# EAGLE design anvil_driver (EAGLE 6.4)
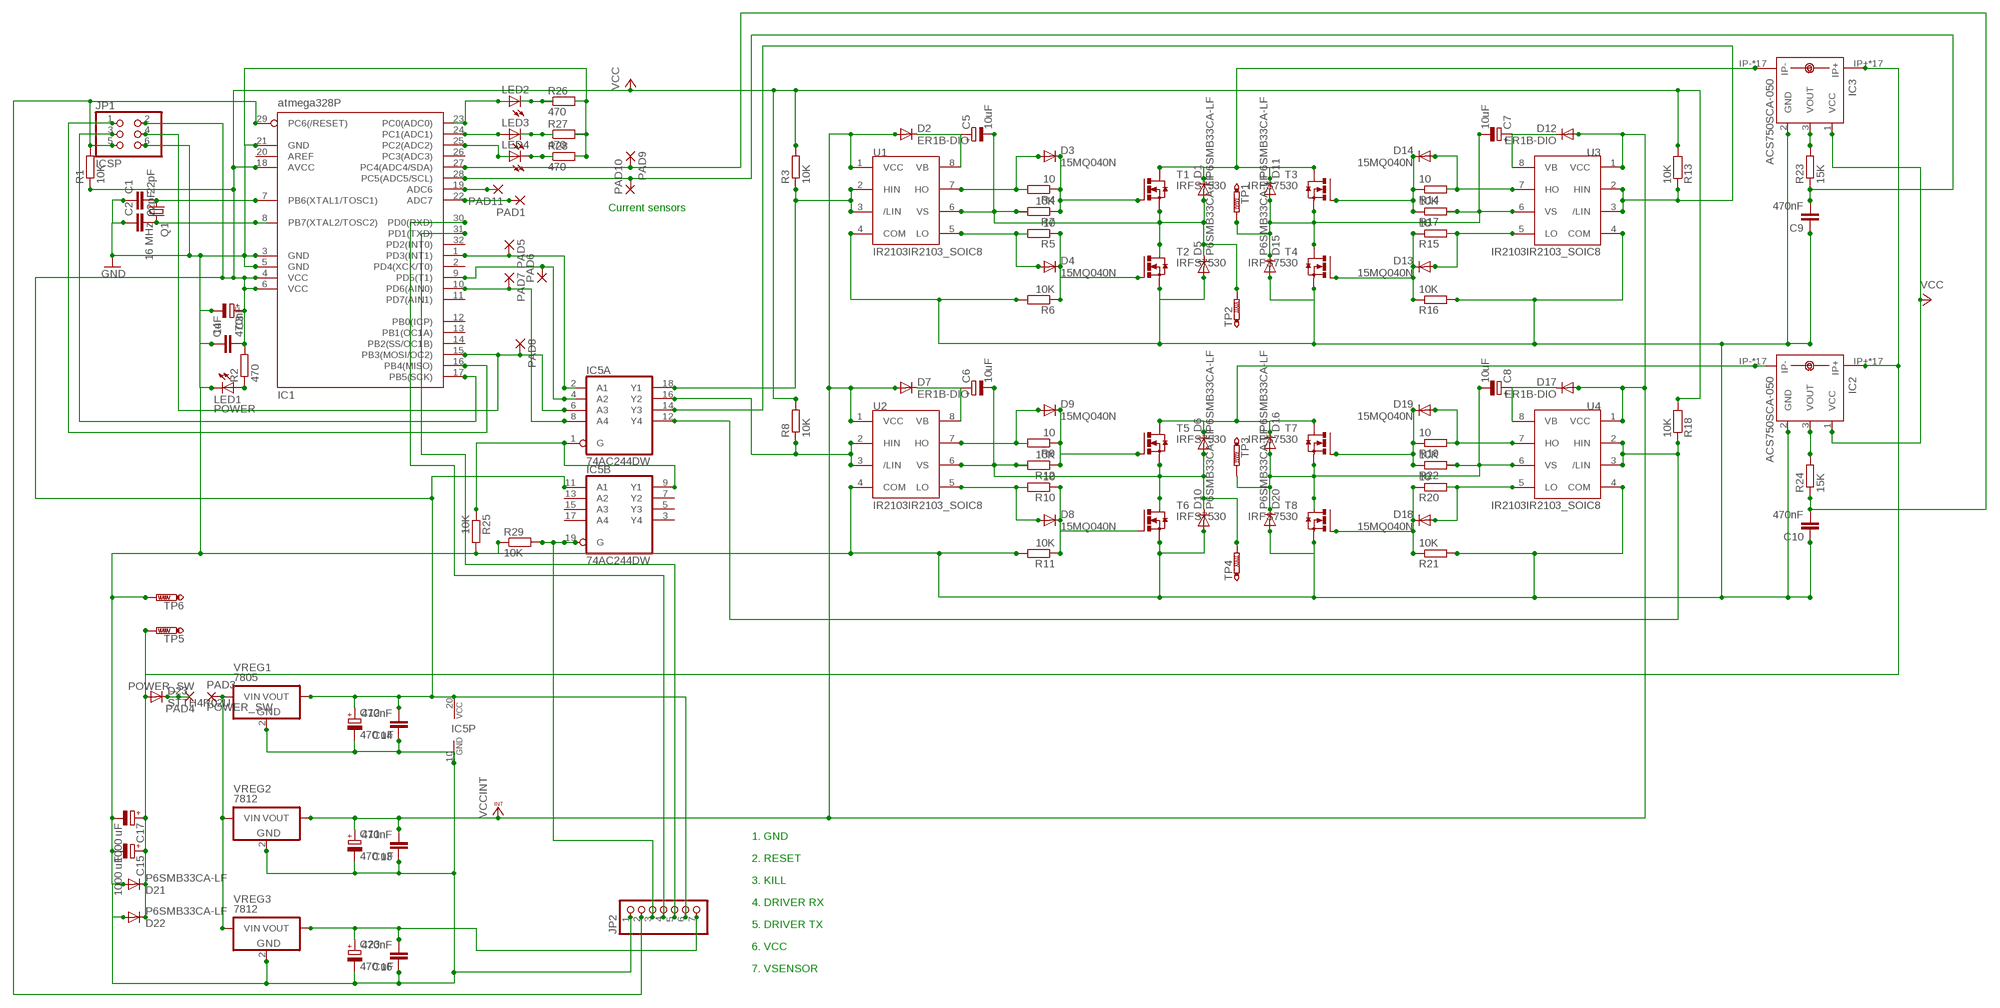
[diagram p0: schematic, sheet 1]

## Parts
C1  22pF  C-EUC1206  [C1206]
C2  22pF  C-EUC1206  [C1206]
C3  1uF  CPOL-EU153CLV-0405  [153CLV-0405]
C4  470nF  C-EUC1206  [C1206]
C5  10uF  CPOL-EU153CLV-0405  [153CLV-0405]
C6  10uF  CPOL-EU153CLV-0405  [153CLV-0405]
C7  10uF  CPOL-EU153CLV-0405  [153CLV-0405]
C8  10uF  CPOL-EU153CLV-0405  [153CLV-0405]
C9  470nF  C-EUC1206  [C1206]
C10  470nF  C-EUC1206  [C1206]
C11  470 uF  CPOL-EU139CLL-2W  [139CLL-2W]
C12  470 uF  CPOL-EU139CLL-2W  [139CLL-2W]
C13  470nF  C-EUC1206  [C1206]
C14  470nF  C-EUC1206  [C1206]
C15  1000 uF  CPOL-EU139CLL-2W  [139CLL-2W]
C16  470nF  C-EUC1206  [C1206]
C17  1000 uF  CPOL-EU139CLL-2W  [139CLL-2W]
C23  470 uF  CPOL-EU139CLL-2W  [139CLL-2W]
D1  P6SMB33CA-LF  DIODE-DO214AA  [DO214AA]
D2  ER1B-DIO  DIODE-DO214AC  [DO214AC]
D3  15MQ040N  DIODE-DO214AC  [DO214AC]
D4  15MQ040N  DIODE-DO214AC  [DO214AC]
D5  P6SMB33CA-LF  DIODE-DO214AA  [DO214AA]
D6  P6SMB33CA-LF  DIODE-DO214AA  [DO214AA]
D7  ER1B-DIO  DIODE-DO214AC  [DO214AC]
D8  15MQ040N  DIODE-DO214AC  [DO214AC]
D9  15MQ040N  DIODE-DO214AC  [DO214AC]
D10  P6SMB33CA-LF  DIODE-DO214AA  [DO214AA]
D11  P6SMB33CA-LF  DIODE-DO214AA  [DO214AA]
D12  ER1B-DIO  DIODE-DO214AC  [DO214AC]
D13  15MQ040N  DIODE-DO214AC  [DO214AC]
D14  15MQ040N  DIODE-DO214AC  [DO214AC]
D15  P6SMB33CA-LF  DIODE-DO214AA  [DO214AA]
D16  P6SMB33CA-LF  DIODE-DO214AA  [DO214AA]
D17  ER1B-DIO  DIODE-DO214AC  [DO214AC]
D18  15MQ040N  DIODE-DO214AC  [DO214AC]
D19  15MQ040N  DIODE-DO214AC  [DO214AC]
D20  P6SMB33CA-LF  DIODE-DO214AA  [DO214AA]
D21  P6SMB33CA-LF  DIODE-DO214AA  [DO214AA]
D22  P6SMB33CA-LF  DIODE-DO214AA  [DO214AA]
D23  STTH4R02U  DIODE-DO214AA  [DO214AA]
IC1  atmega328P  MEGA8-AI  [TQFP32-08]
IC2  ACS750SCA-050  [ACS75050]
IC3  ACS750SCA-050  [ACS75050]
IC5  74AC244DW  [SO20W]
JP1  ICSP  PINHD-2X3_2.54-SMD  [2X03SMD]
JP2  PINHD-1X7_2.54  [1X07]
LED1  POWER  LEDSMT1206  [1206]
LED2  LEDSMT1206  [1206]
LED3  LEDSMT1206  [1206]
LED4  LEDSMT1206  [1206]
PAD1  SMD2  [SMD1,27-2,54]
PAD3  POWER_SW  1,6/0,8  [1,6/0,8]
PAD4  POWER_SW  1,6/0,8  [1,6/0,8]
PAD5  SMD2  [SMD1,27-2,54]
PAD6  SMD2  [SMD1,27-2,54]
PAD7  SMD2  [SMD1,27-2,54]
PAD8  SMD2  [SMD1,27-2,54]
PAD9  SMD2  [SMD1,27-2,54]
PAD10  SMD2  [SMD1,27-2,54]
PAD11  SMD2  [SMD1,27-2,54]
Q1  16 MHz  CSM-7X-DU  [CSM-7X-DU]
R1  10K  R-EU_M1206  [M1206]
R2  470  R-EU_M1206  [M1206]
R3  10K  R-EU_M1206  [M1206]
R4  10  R-EU_M1206  [M1206]
R5  10  R-EU_M1206  [M1206]
R6  10K  R-EU_M1206  [M1206]
R7  10K  R-EU_M1206  [M1206]
R8  10K  R-EU_M1206  [M1206]
R9  10  R-EU_M1206  [M1206]
R10  10  R-EU_M1206  [M1206]
R11  10K  R-EU_M1206  [M1206]
R12  10K  R-EU_M1206  [M1206]
R13  10K  R-EU_M1206  [M1206]
R14  10  R-EU_M1206  [M1206]
R15  10  R-EU_M1206  [M1206]
R16  10K  R-EU_M1206  [M1206]
R17  10K  R-EU_M1206  [M1206]
R18  10K  R-EU_M1206  [M1206]
R19  10  R-EU_M1206  [M1206]
R20  10  R-EU_M1206  [M1206]
R21  10K  R-EU_M1206  [M1206]
R22  10K  R-EU_M1206  [M1206]
R23  15K  R-EU_M1206  [M1206]
R24  15K  R-EU_M1206  [M1206]
R25  10K  R-EU_M1206  [M1206]
R26  470  R-EU_M1206  [M1206]
R27  470  R-EU_M1206  [M1206]
R28  470  R-EU_M1206  [M1206]
R29  10K  R-EU_M1206  [M1206]
T1  IRFS7530  IRF3805S  [DDPAK7]
T2  IRFS7530  IRF3805S  [DDPAK7]
T3  IRFS7530  IRF3805S  [DDPAK7]
T4  IRFS7530  IRF3805S  [DDPAK7]
T5  IRFS7530  IRF3805S  [DDPAK7]
T6  IRFS7530  IRF3805S  [DDPAK7]
T7  IRFS7530  IRF3805S  [DDPAK7]
T8  IRFS7530  IRF3805S  [DDPAK7]
TP1  PTR1PAD1-20  [P1-20]
TP2  PTR1PAD1-20  [P1-20]
TP3  PTR1PAD1-20  [P1-20]
TP4  PTR1PAD1-20  [P1-20]
TP5  PTR1PAD1-20  [P1-20]
TP6  PTR1PAD1-20  [P1-20]
U1  IR2103IR2103_SOIC8  [SO08]
U2  IR2103IR2103_SOIC8  [SO08]
U3  IR2103IR2103_SOIC8  [SO08]
U4  IR2103IR2103_SOIC8  [SO08]
VREG1  7805  VREG_3PINS-D2PAK  [D2PAK]
VREG2  7812  VREG_3PINS-D2PAK  [D2PAK]
VREG3  7812  VREG_3PINS-D2PAK  [D2PAK]

## Nets
GND: C1.1 C2.1 C3.- C4.1 C9.1 C10.1 C11.- C12.- C13.1 C14.1 C15.- C16.1 C17.- C23.- D5.A D10.A D15.A D20.A D21.A D22.A IC1.3(GND) IC1.5(GND) IC1.21(GND) IC2.2(GND) IC3.2(GND) IC5.10(P:GND) JP1.6 JP2.1 LED1.C R6.2 R11.2 R16.2 R21.2 R25.2 R26.2 R27.2 R28.2 R29.1 T2.2(S) T2.3(S) T2.5(S) T2.6(S) T2.7(S) T4.2(S) T4.3(S) T4.5(S) T4.6(S) T4.7(S) T6.2(S) T6.3(S) T6.5(S) T6.6(S) T6.7(S) T8.2(S) T8.3(S) T8.5(S) T8.6(S) T8.7(S) TP6.TP U1.4(COM) U2.4(COM) U3.4(COM) U4.4(COM) VREG1.2(GND) VREG2.2(GND) VREG3.2(GND)
N$1: D1.C D11.C IC3.IP- IC3.IP-@2(IP-) IC3.IP-@3(IP-) IC3.IP-@4(IP-) IC3.IP-@5(IP-) IC3.IP-@6(IP-) IC3.IP-@7(IP-) IC3.IP-@8(IP-) IC3.IP-@9(IP-) IC3.IP-@10(IP-) IC3.IP-@11(IP-) IC3.IP-@12(IP-) IC3.IP-@13(IP-) IC3.IP-@14(IP-) IC3.IP-@15(IP-) IC3.IP-@16(IP-) IC3.IP-@17(IP-) T1.4(D) T3.4(D)
N$2: IC5.18(A:Y1) R3.1 U1.2(HIN) U1.3(/LIN)
N$3: IC1.24(PC1(ADC1)) LED3.A
N$4: IC1.1(PD3(INT1)) IC5.2(A:A1) PAD5.1(P)
N$5: IC1.16(PB4(MISO)) JP1.1
N$6: IC1.17(PB5(SCK)) JP1.3
N$8: C1.2 IC1.7(PB6(XTAL1/TOSC1)) Q1.1
N$9: C2.2 IC1.8(PB7(XTAL2/TOSC2)) Q1.2
N$10: C5.- D1.A D5.C R7.2 T1.2(S) T1.3(S) T1.5(S) T1.6(S) T1.7(S) T2.4(D) TP2.TP U1.6(VS)
N$11: LED1.A R2.1
N$12: D3.A R4.2 U1.7(HO)
N$13: D4.A R5.2 U1.5(LO)
N$14: D4.C R5.1 R6.1 T2.1(G)
N$15: D3.C R4.1 R7.1 T1.1(G)
N$16: C15.+ C17.+ D21.C D22.C D23.A IC2.IP+ IC2.IP+@2(IP+) IC2.IP+@3(IP+) IC2.IP+@4(IP+) IC2.IP+@5(IP+) IC2.IP+@6(IP+) IC2.IP+@7(IP+) IC2.IP+@8(IP+) IC2.IP+@9(IP+) IC2.IP+@10(IP+) IC2.IP+@11(IP+) IC2.IP+@12(IP+) IC2.IP+@13(IP+) IC2.IP+@14(IP+) IC2.IP+@15(IP+) IC2.IP+@16(IP+) IC2.IP+@17(IP+) IC3.IP+ IC3.IP+@2(IP+) IC3.IP+@3(IP+) IC3.IP+@4(IP+) IC3.IP+@5(IP+) IC3.IP+@6(IP+) IC3.IP+@7(IP+) IC3.IP+@8(IP+) IC3.IP+@9(IP+) IC3.IP+@10(IP+) IC3.IP+@11(IP+) IC3.IP+@12(IP+) IC3.IP+@13(IP+) IC3.IP+@14(IP+) IC3.IP+@15(IP+) IC3.IP+@16(IP+) IC3.IP+@17(IP+) TP5.TP
N$17: IC5.16(A:Y2) R8.1 U2.2(HIN) U2.3(/LIN)
N$18: D6.C D16.C IC2.IP- IC2.IP-@2(IP-) IC2.IP-@3(IP-) IC2.IP-@4(IP-) IC2.IP-@5(IP-) IC2.IP-@6(IP-) IC2.IP-@7(IP-) IC2.IP-@8(IP-) IC2.IP-@9(IP-) IC2.IP-@10(IP-) IC2.IP-@11(IP-) IC2.IP-@12(IP-) IC2.IP-@13(IP-) IC2.IP-@14(IP-) IC2.IP-@15(IP-) IC2.IP-@16(IP-) IC2.IP-@17(IP-) T5.4(D) T7.4(D)
N$19: C6.- D6.A D10.C R12.2 T5.2(S) T5.3(S) T5.5(S) T5.6(S) T5.7(S) T6.4(D) TP4.TP U2.6(VS)
N$20: D9.A R9.2 U2.7(HO)
N$21: D8.A R10.2 U2.5(LO)
N$22: D8.C R10.1 R11.1 T6.1(G)
N$23: D9.C R9.1 R12.1 T5.1(G)
N$24: C9.2 IC1.28(PC5(ADC5/SCL)) PAD10.1(P) R23.1
N$25: IC3.3(VOUT) R23.2
N$26: IC5.14(A:Y3) R13.1 U3.2(HIN) U3.3(/LIN)
N$27: C7.- D11.A D15.C R17.2 T3.2(S) T3.3(S) T3.5(S) T3.6(S) T3.7(S) T4.4(D) TP1.TP U3.6(VS)
N$28: D14.A R14.2 U3.7(HO)
N$29: D13.A R15.2 U3.5(LO)
N$30: D13.C R15.1 R16.1 T4.1(G)
N$31: D14.C R14.1 R17.1 T3.1(G)
N$32: C10.2 IC1.27(PC4(ADC4/SDA)) PAD9.1(P) R24.1
N$33: D23.C PAD4.1(P)
N$34: IC1.9(PD5(T1)) IC5.4(A:A2) PAD6.1(P)
N$35: C8.- D16.A D20.C R22.2 T7.2(S) T7.3(S) T7.5(S) T7.6(S) T7.7(S) T8.4(D) TP3.TP U4.6(VS)
N$36: D19.A R19.2 U4.7(HO)
N$37: D18.A R20.2 U4.5(LO)
N$38: D18.C R20.1 R21.1 T8.1(G)
N$39: D19.C R19.1 R22.1 T7.1(G)
N$41: C16.2 C23.+ JP2.7 VREG3.3(VOUT)
N$42: IC1.15(PB3(MOSI/OC2)) IC5.6(A:A3) JP1.4 PAD8.1(P)
N$43: IC1.10(PD6(AIN0)) IC5.8(A:A4) PAD7.1(P)
N$44: LED2.C R26.1
N$45: IC5.12(A:Y4) R18.1 U4.2(HIN) U4.3(/LIN)
N$46: LED3.C R27.1
N$47: IC1.19(ADC6) PAD11.1(P)
N$48: IC1.23(PC0(ADC0)) LED2.A
N$49: LED4.C R28.1
N$50: IC1.31(PD1(TXD))
N$51: IC1.25(PC2(ADC2)) LED4.A
N$52: PAD3.1(P) VREG1.1(VIN) VREG2.1(VIN) VREG3.1(VIN)
N$53: IC2.3(VOUT) R24.2
N$54: IC1.30(PD0(RXD)) JP2.4
N$55: JP2.5
N$56: IC5.1(A:G) IC5.9(B:Y1) R25.1
N$57: IC5.19(B:G) JP2.3 R29.2
N$58: IC1.22(ADC7) PAD1.1(P)
RESET: IC1.29(PC6(/RESET)) JP1.5 JP2.2 R1.2
VB_1: C5.+ D2.C U1.8(VB)
VB_2: C7.+ D12.C U3.8(VB)
VB_3: C8.+ D17.C U4.8(VB)
VB_4: C6.+ D7.C U2.8(VB)
VCC: C3.+ C4.2 C12.+ C14.2 IC1.4(VCC) IC1.6(VCC) IC1.18(AVCC) IC2.1(VCC) IC3.1(VCC) IC5.11(B:A1) IC5.20(P:VCC) JP1.2 JP2.6 R1.1 R2.2 R3.2 R8.2 R13.2 R18.2 VREG1.3(VOUT)
VCCINT: C11.+ C13.2 D2.A D7.A D12.A D17.A U1.1(VCC) U2.1(VCC) U3.1(VCC) U4.1(VCC) VREG2.3(VOUT)
Unconnected: IC1.2(PD4(XCK/T0)) IC1.11(PD7(AIN1)) IC1.12(PB0(ICP)) IC1.13(PB1(OC1A)) IC1.14(PB2(SS/OC1B)) IC1.20(AREF) IC1.26(PC3(ADC3)) IC1.32(PD2(INT0)) IC5.3(B:Y4) IC5.5(B:Y3) IC5.7(B:Y2) IC5.13(B:A2) IC5.15(B:A3) IC5.17(B:A4)

## Notes on the sheet
- Current sensors
- 1. GND
- 2. RESET
- 3. KILL
- 4. DRIVER RX
- 5. DRIVER TX
- 6. VCC
- 7. VSENSOR

## Library data of the parts
C1 C2 C4 C9 C10 C13 C14 C16 = resistor:C-EU: CAPACITOR, European symbol
C3 C5-C8 C11 C12 C15 C17 C23 = resistor:CPOL-EU: POLARIZED CAPACITOR, European symbol
D1-D23 = diode:DIODE-: DIODE
IC1 = atmel:MEGA8: MICROCONTROLLER 8 Kbytes FLASH, 1 kbytes SRAM, 512 bytes EEPROM, USART, 6-channel 10 bit ADC, 2-channel 8 bit ADC Pin compatible with Atmega48, ATMega88, ATMega168 Source: avr.lbr; MPN: ATMEGA8-16AU; OC_FARNELL: 9171371; OC_NEWARK: 73M8863
IC2 IC3 = allegro:ACS750*CA-050: Current Sensor display layer 49 Reference in BRD and place VIAs on circles Source: www.allegromicro.com/datafile/0750-050.pdf; MF: ALLEGRO MICROSYSTEMS, INC.; MPN: ACS750SCA-050; OC_FARNELL: 1457175; OC_NEWARK: 81H6588
IC5 = 74xx-eu:74*244: Octal BUFFER and LINE DRIVER, 3-state
JP1 = pinhead:PINHD-2X3: PIN HEADER
JP2 = pinhead:PINHD-1X7: PIN HEADER
LED1-LED4 = led:LED: LED OSRAM: - CHIPLED LG R971, LG N971, LY N971, LG Q971, LY Q971, LO R971, LY R971 LH N974, LH R974 LS Q976, LO Q976, LY Q976 LO Q996 - Hyper CHIPLED LW Q18S LB Q993, LB Q99A, LB R99A - SideLED LS A670, LO A670, LY A670, LG A670, LP A670 LB A673, LV A673, LT A673, LW A673 LH A674 LY A675 LS A676, LA A676, LO A676, LY A676, LW A676 LS A679, LY A679, LG A679 - Hyper Micro SIDELED® LS Y876, LA Y876, LO Y876, LY Y876 LT Y87S - SmartLED LW L88C, LW L88S LB L89C, LB L89S, LG L890 LS L89K, LO L89K, LY L89K LS L896, LA L896, LO L896, LY L896 - TOPLED LS T670, LO T670, LY T670, LG T670, LP T670 LSG T670, LSP T670, LSY T670, LOP T670, LYG T670 LG T671, LOG T671, LSG T671 LB T673, LV T673, LT T673, LW T673 LH T674 LS T676, LA T676, LO T676, LY T676, LB T676, LH T676, LSB T676, LW T676 LB T67C, LV T67C, LT T67C, LS T67K, LO T67K, LY T67K, LW E67C LS E67B, LA E67B, LO E67B, LY E67B, LB E67C, LV E67C, LT E67C LW T67C LS T679, LY T679, LG T679 LS T770, LO T770, LY T770, LG T770, LP T770 LB T773, LV T773, LT T773, LW T773 LH T774 LS E675, LA E675, LY E675, LS T675 LS T776, LA T776, LO T776, LY T776, LB T776 LHGB T686 LT T68C, LB T68C - Hyper Mini TOPLED® LB M676 - Mini TOPLED Santana® LG M470 LS M47K, LO M47K, LY M47K Source: http://www.osram.convergy.de LUXEON: - LUMILED® LXK2-PW12-R00, LXK2-PW12-S00, LXK2-PW14-U00, LXK2-PW14-V00 LXK2-PM12-R00, LXK2-PM12-S00, LXK2-PM14-U00 LXK2-PE12-Q00, LXK2-PE12-R00, LXK2-PE12-S00, LXK2-PE14-T00, LXK2-PE14-U00 LXK2-PB12-K00, LXK2-PB12-L00, LXK2-PB12-M00, LXK2-PB14-N00, LXK2-PB14-P00, LXK2-PB14-Q00 LXK2-PR12-L00, LXK2-PR12-M00, LXK2-PR14-Q00, LXK2-PR14-R00 LXK2-PD12-Q00, LXK2-PD12-R00, LXK2-PD12-S00 LXK2-PH12-R00, LXK2-PH12-S00 LXK2-PL12-P00, LXK2-PL12-Q00, LXK2-PL12-R00 Source: www.luxeon.com KINGBRIGHT: KA-3528ASYC Source: www.kingbright.com
PAD1 PAD5-PAD11 = wirepad:SMD2: SMD PAD
PAD3 PAD4 = wirepad:1,6/0,8: THROUGH-HOLE PAD
Q1 = crystal:CSM-7X-DU: SMD CRYSTAL Source: www.ecsxtal.com .. Crystal 3.6864MHz CSM_7X_DU.PDF; OC_FARNELL: unknown; OC_NEWARK: unknown
R1-R29 = resistor:R-EU_: RESISTOR, European symbol
T1-T8 = anvil:IRF3805S
TP1-TP6 = testpad:PTR1: TEST PIN
U1-U4 = drivers:IR2103: IR2101 HIGH AND LOW SIDE DRIVER Product Summary VOFFSET 600V max. IO+/- 130 mA / 270 mA VOUT 10 - 20V ton/off (typ.) 160 & 150 ns Delay Matching 50 ns IR2101(S)/IR2102(S) & (PbF) Features ? Floating channel designed for bootstrap operation Fully operational to +600V Tolerant to negative transient voltage dV/dt immune ? Gate drive supply range from 10 to 20V ? Undervoltage lockout ? 3.3V, 5V, and 15V logic input compatible ? Matched propagation delay for both channels ? Outputs in phase with inputs (IR2101) or out of phase with inputs (IR2102) ? Also available LEAD-FREE Description The IR2101(S)/IR2102(S) are high voltage, high speed power MOSFET and IGBT drivers with independent high and low side referenced output channels. Proprietary HVIC and latch immune CMOS technologies enable ruggedized monolithic construction. The logic input is compatible with standard CMOS or LSTTL output, down to 3.3V logic. The output drivers feature a high pulse current buffer stage designed for minimum driver cross-conduction. The floating channel can be used to drive an N-channel power MOSFET or IGBT in the high side configuration which operates up to 600 volts.
VREG1-VREG3 = dp_devices:VREG_3PINS: Various 3 pin voltage regulators in different packages Double check the right pinout for the right part

## Board
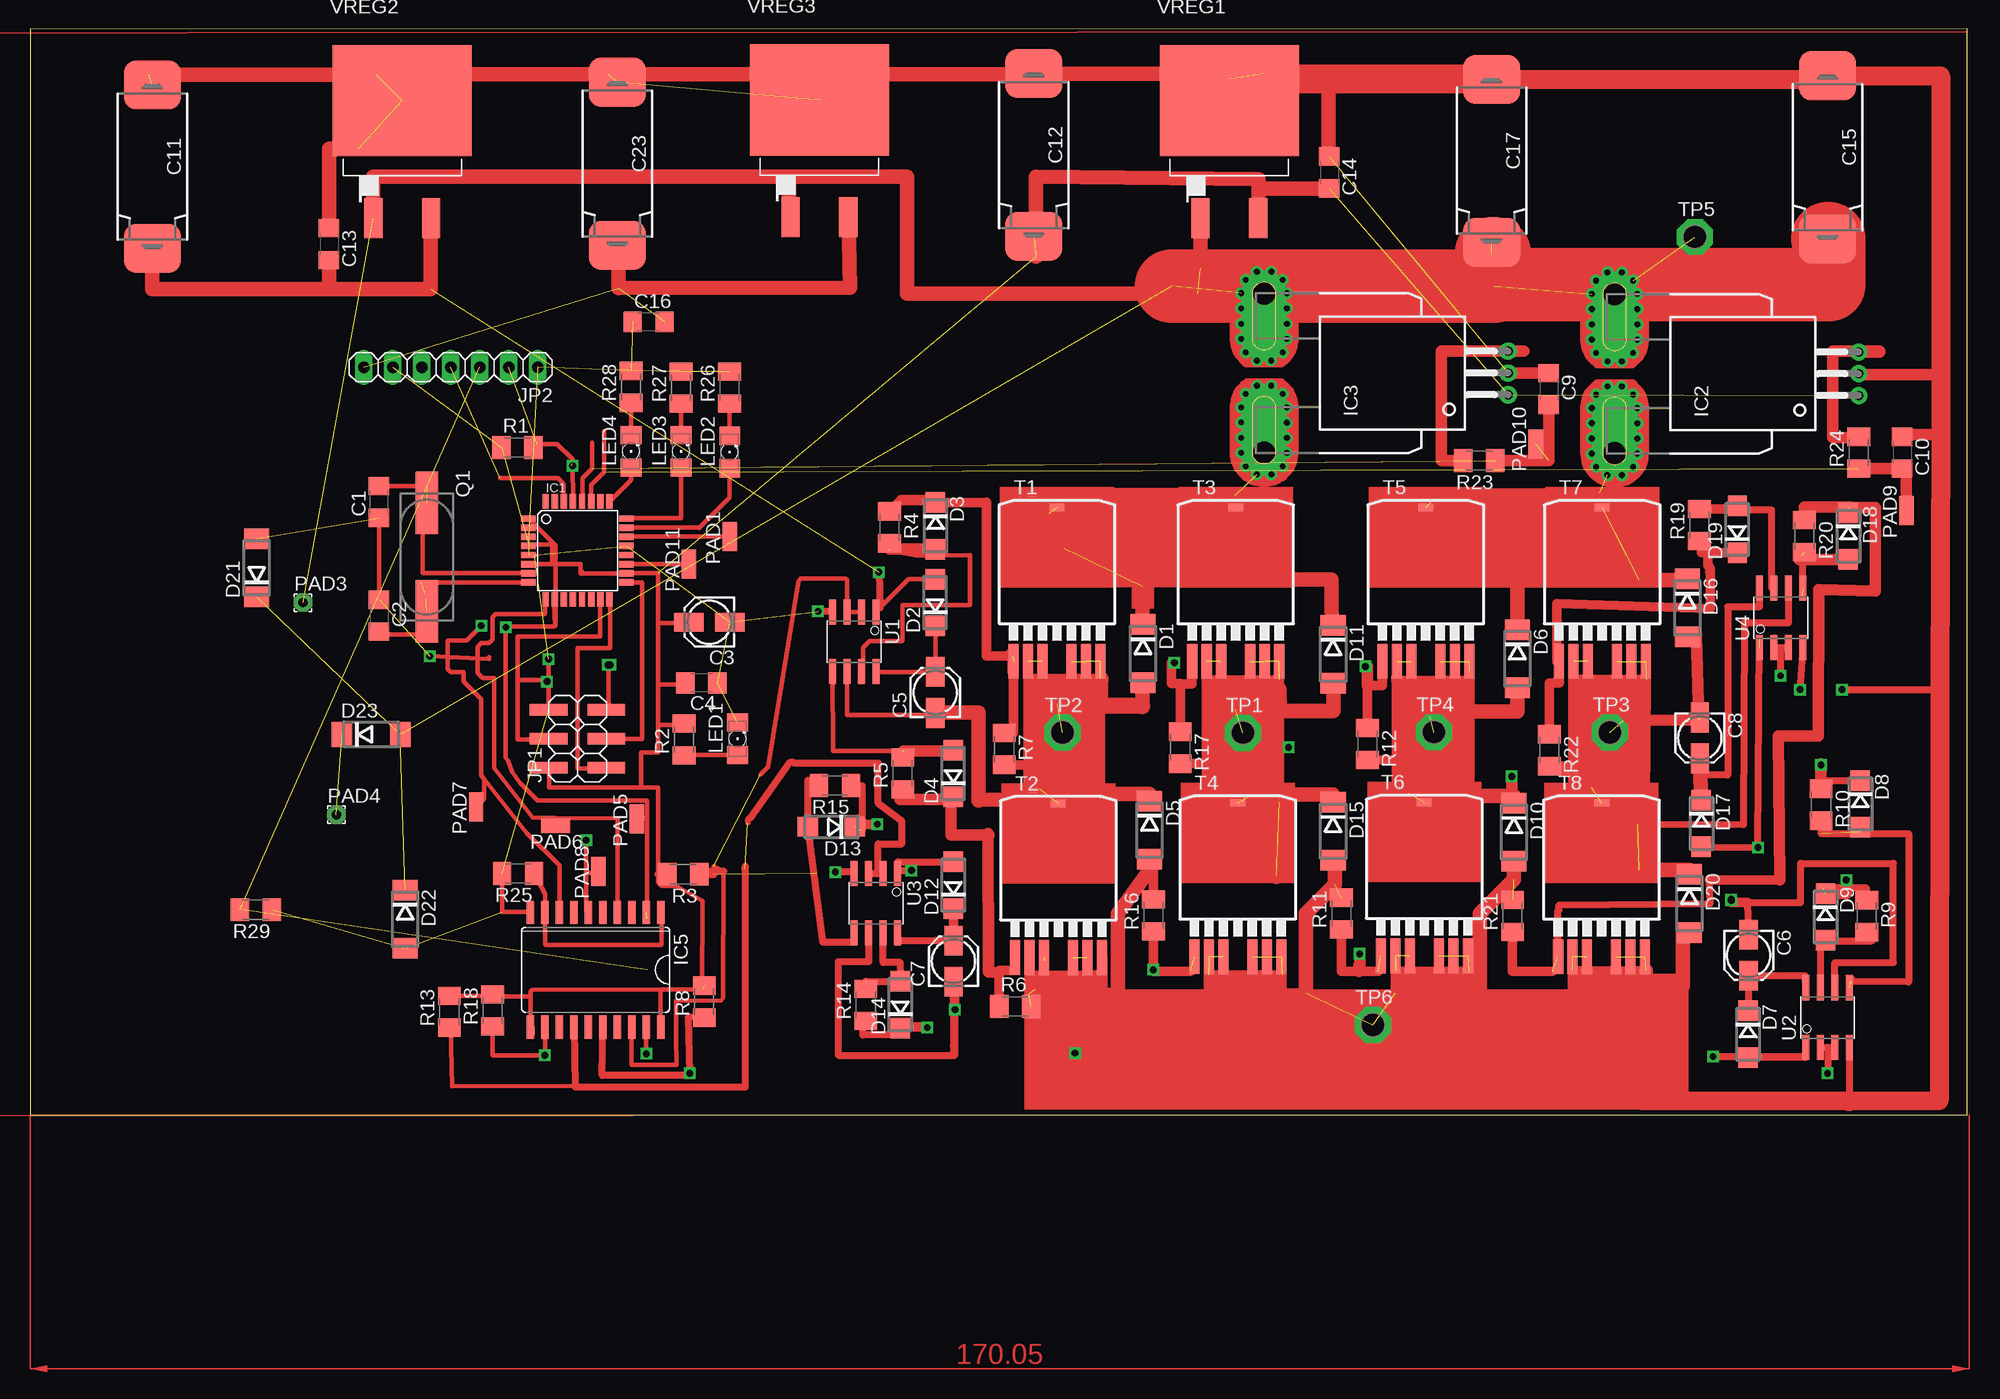
[diagram p1: board, top side]
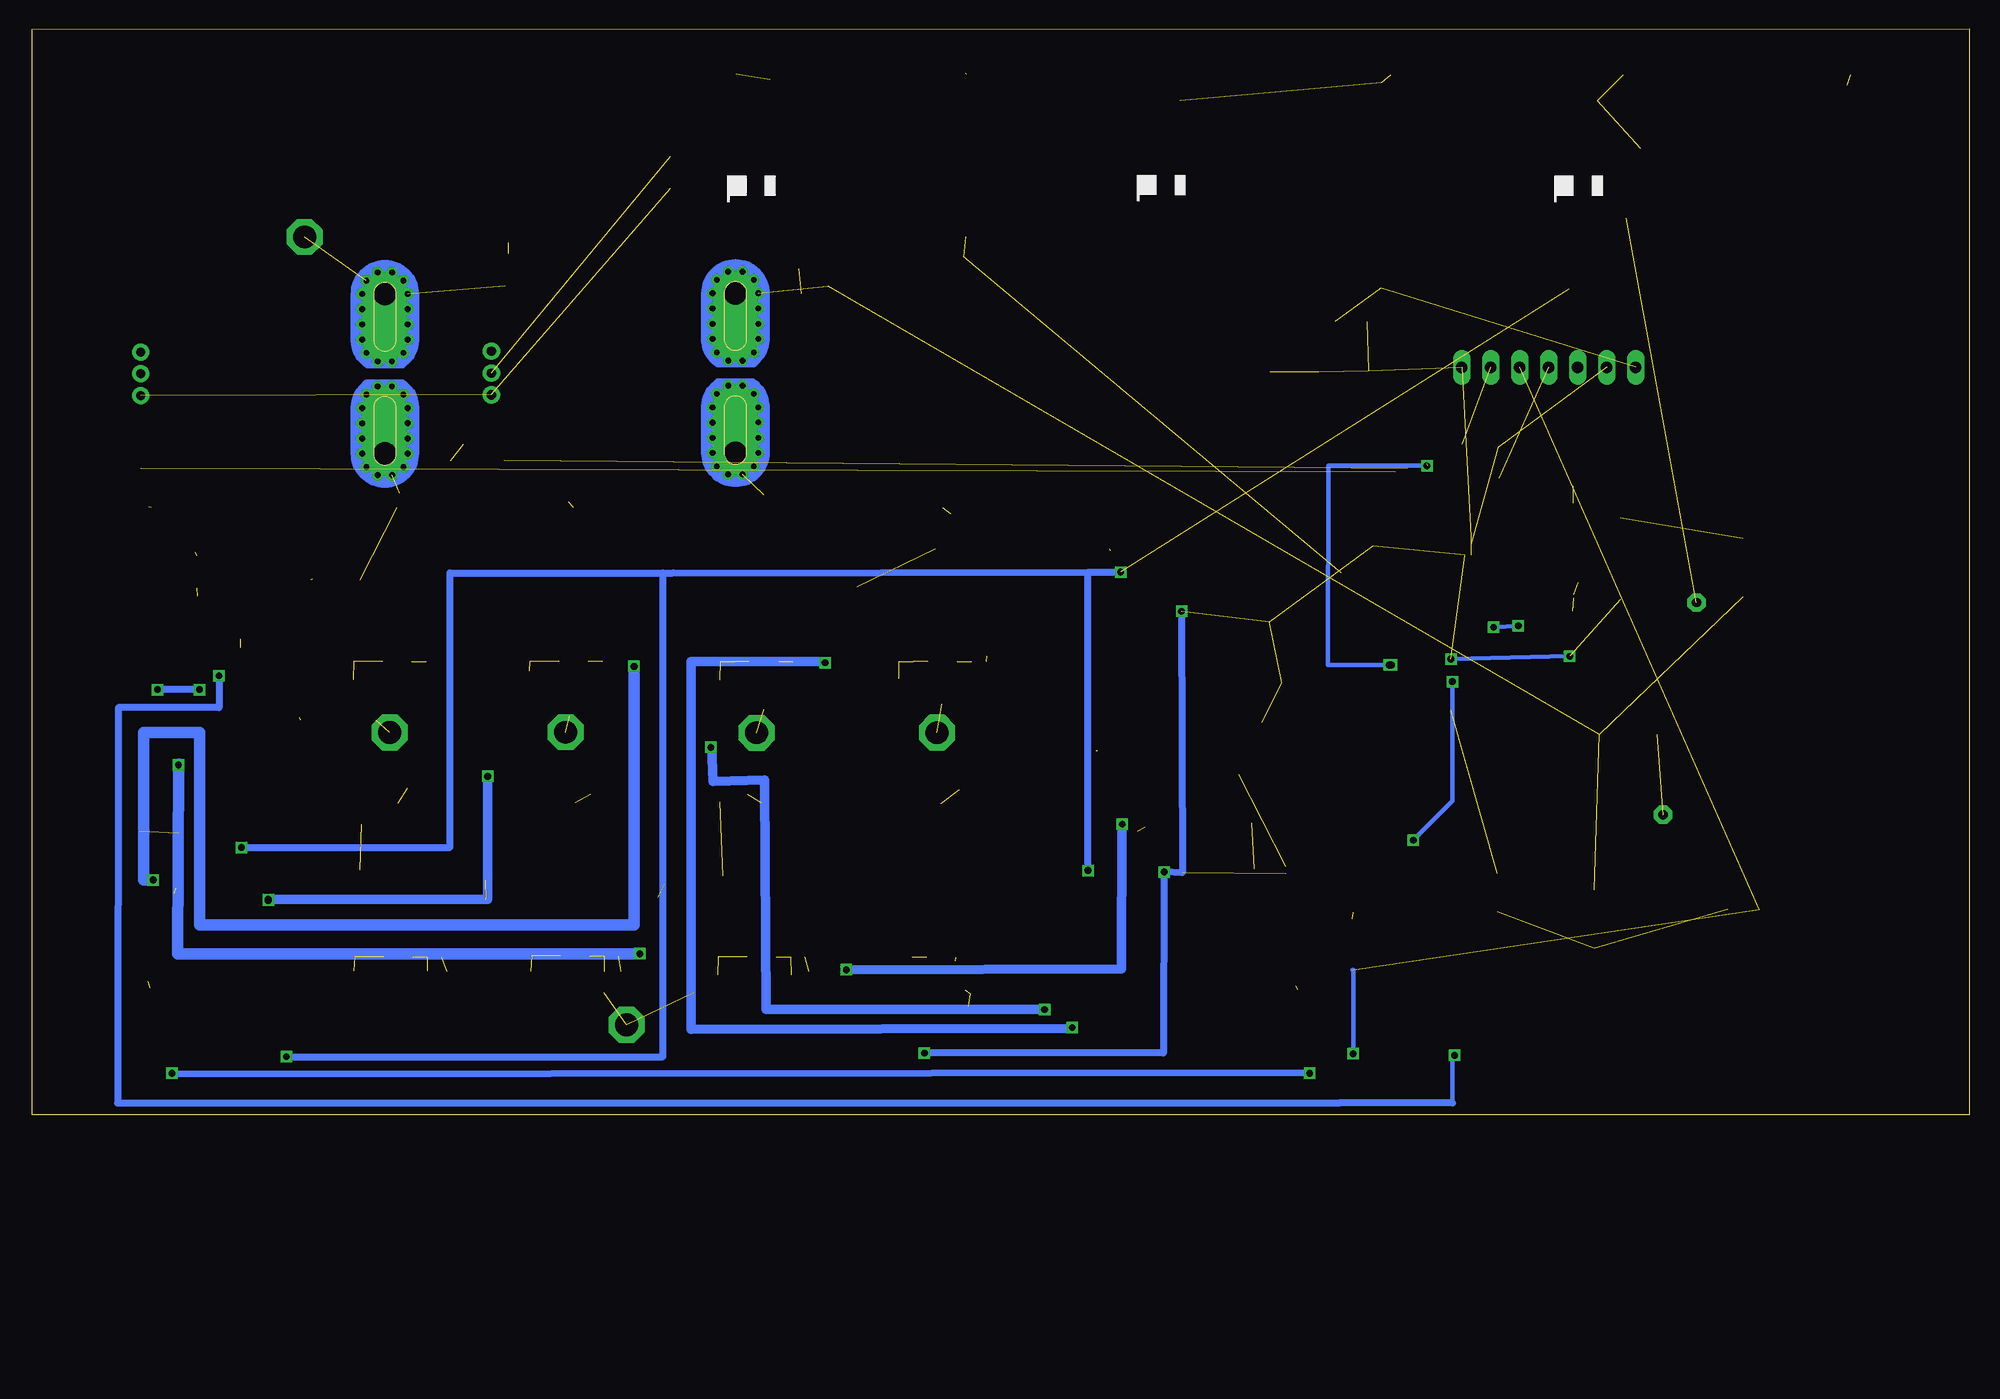
[diagram p2: board, bottom side, seen from below]

Size 169.87 x 95.24 mm. Coordinates in mm from the lower left corner, seen from the top.
Outline: 0,0 169.85,0 169.87,95.16 0,95.24 0,0
Copper layers (1*16): Top 0.035mm / dielectric 1.5mm / Bottom 0.035mm
Design rules "default": minimum track width 10mil, minimum drill 24mil, track to track 8mil, track to pad 8mil, pad to pad 8mil, via to via 8mil, smd to smd 8mil, copper to edge 40mil, drill to drill 8mil, minimum pad ring 10mil, minimum via ring 8mil, stop-mask expansion 4mil, vias tented up to drill 0mil, thermal gap 10mil

### Footprints (pad centres in the part's own frame; a part is rotated, then mirrored left to right if it is on the bottom)
C1206 = smd 1.6 x 1.8: 1 -1.4,0; 2 1.4,0
153CLV-0405 = smd 2.6 x 1.6: + 1.8,0; - -1.8,0
139CLL-2W = smd 4.3 x 5: + 7.15,0; - -7.15,0
DO214AA = smd 1.8 x 2.2: A 2.55,0; C -2.55,0
DO214AC = smd 1.8 x 1.7: A 2.05,0; C -2.05,0
TQFP32-08 = smd 1.27 x 0.559: 1 -4.293,2.8; 2 -4.293,2; 3 -4.293,1.2; 4 -4.293,0.4; 5 -4.293,-0.4; 6 -4.293,-1.2; 7 -4.293,-2; 8 -4.293,-2.8; 17 4.293,-2.8; 18 4.293,-2; 19 4.293,-1.2; 20 4.293,-0.4; 21 4.293,0.4; 22 4.293,1.2; 23 4.293,2; 24 4.293,2.8 | smd 0.559 x 1.27: 9 -2.8,-4.293; 10 -2,-4.293; 11 -1.2,-4.293; 12 -0.4,-4.293; 13 0.4,-4.293; 14 1.2,-4.293; 15 2,-4.293; 16 2.8,-4.293; 25 2.8,4.293; 26 2,4.293; 27 1.2,4.293; 28 0.4,4.293; 29 -0.4,4.293; 30 -1.2,4.293; 31 -2,4.293; 32 -2.8,4.293
ACS75050 = drill 0.8 pad 1.5: 1 -1.91,-21.4; 2 0,-21.4; 3 1.91,-21.4 | drill 2 pad 4 offset: IP+ 7,0; IP- -7,0 | drill 0.5 pad 0.9: IP+@2 8.89,-0.635; IP+@3 8.89,0.635; IP+@4 8.175,1.625; IP+@5 7,2; IP+@6 5.675,2; IP+@7 4.325,2; IP+@8 3,2; IP+@9 1.825,1.625; IP+@10 1.1,0.625; IP+@11 1.1,-0.625; IP+@12 1.825,-1.625; IP+@13 3,-2; IP+@14 4.325,-2; IP+@15 5.675,-2; IP+@16 7,-2; IP+@17 8.175,-1.625; IP-@2 -8.89,-0.635; IP-@3 -8.89,0.635; IP-@4 -8.175,1.625; IP-@5 -7,2; IP-@6 -5.675,2; IP-@7 -4.325,2; IP-@8 -3,2; IP-@9 -1.825,1.625; IP-@10 -1.1,0.625; IP-@11 -1.1,-0.625; IP-@12 -1.825,-1.625; IP-@13 -3,-2; IP-@14 -4.35,-2; IP-@15 -5.675,-2; IP-@16 -7,-2; IP-@17 -8.175,-1.625
SO20W = smd 0.66 x 2.032: 1 -5.715,-5.029; 2 -4.445,-5.029; 3 -3.175,-5.029; 4 -1.905,-5.029; 5 -0.635,-5.029; 6 0.635,-5.029; 7 1.905,-5.029; 8 3.175,-5.029; 9 4.445,-5.029; 10 5.715,-5.029; 11 5.715,5.029; 12 4.445,5.029; 13 3.175,5.029; 14 1.905,5.029; 15 0.635,5.029; 16 -0.635,5.029; 17 -1.905,5.029; 18 -3.175,5.029; 19 -4.445,5.029; 20 -5.715,5.029
2X03SMD = smd 1.016 x 3.302: 1 -1.27,-3.81; 2 -1.27,1.27; 3 1.27,-3.81; 4 1.27,1.27; 5 3.81,-3.81; 6 3.81,1.27
1X07 = drill 1.016 long: 1 -7.62,0; 2 -5.08,0; 3 -2.54,0; 4 0,0; 5 2.54,0; 6 5.08,0; 7 7.62,0
1206 = smd 1.6 x 1.803: A -1.422,0; C 1.422,0
SMD1,27-2,54 = smd 1.27 x 2.54: 1 0,0
1,6/0,8 = drill 0.813 pad 1.6 octagon: 1 0,0
CSM-7X-DU = smd 5.5 x 2: 1 -4.75,0; 2 4.75,0
M1206 = smd 1.6 x 2: 1 -1.4,0; 2 1.4,0
DDPAK7 = smd 0.889 x 3.048: 1 -3.81,-6.985; 2 -2.54,-6.985; 3 -1.27,-6.985; 5 1.27,-6.985; 6 2.54,-6.985; 7 3.81,-6.985 | smd 1.27 x 0.635: 4 0,6.5
P1-20 = drill 2.007 pad 3.15 octagon: TP 0,0
SO08 = smd 0.61 x 2.21: 1 -1.905,-2.616; 2 -0.635,-2.616; 3 0.635,-2.616; 4 1.905,-2.616; 5 1.905,2.616; 6 0.635,2.616; 7 -0.635,2.616; 8 -1.905,2.616
D2PAK = smd 1.6 x 3.5: 1 -2.54,-10.28; 3 2.54,-10.28 | smd 12.2 x 9.75: 2 0,0

### Placement (x,y rotation side)
C1  30.61,53.72 90 top
C2  30.61,43.75 270 top
C3  59.56,43.18 180 top
C4  58.86,37.85 180 top
C5  79.38,37.02 90 top
C6  150.69,13.97 270 top
C7  80.97,13.46 90 top
C8  146.4,33.02 270 top
C9  133.16,63.63 270 top
C10  164.15,58.04 270 top
C11  10.73,83.12 270 top
C12  88.01,84.14 270 top
C13  26.23,76.33 270 top
C14  113.92,82.61 270 top
C15  157.61,83.95 270 top
C16  54.23,69.53 0 top
C17  128.14,83.63 270 top
C23  51.5,83.38 270 top
D1  97.58,40.43 270 top
D2  79.38,44.89 90 top
D3  79.38,51.63 270 top
D4  80.96,29.91 90 top
D5  98.16,24.95 270 top
D6  130.4,39.98 270 top
D7  150.62,7.05 270 top
D8  160.46,27.24 270 top
D9  157.42,17.34 270 top
D10  130.11,24.77 270 top
D11  114.26,40.37 270 top
D12  80.97,20.12 90 top
D13  70.27,25.24 180 top
D14  76.32,9.65 90 top
D15  114.26,24.85 270 top
D16  145.3,44.43 270 top
D17  146.53,25.53 270 top
D18  159.42,50.73 270 top
D19  149.7,51.32 90 top
D20  145.5,18.51 270 top
D21  19.88,47.94 90 top
D22  32.89,17.14 270 top
D23  29.91,33.34 0 top
IC1  48.01,49.47 0 top
IC2  138.94,64.96 90 top
IC3  108.2,65.02 90 top
IC5  49.59,12.7 180 top
JP1  46.74,31.69 90 top
JP2  36.89,65.53 180 top
LED1  62.04,32.96 90 top
LED2  61.34,58.1 90 top
LED3  57.09,58.17 90 top
LED4  52.7,58.17 90 top
PAD1  61.34,50.67 0 top
PAD3  23.94,44.89 0 top
PAD4  26.86,26.29 0 top
PAD5  53.21,25.91 0 top
PAD6  46.1,25.34 90 top
PAD7  39.12,26.99 0 top
PAD8  49.85,21.34 0 top
PAD9  164.53,52.96 0 top
PAD10  132.02,58.8 0 top
PAD11  57.79,48.26 0 top
Q1  34.8,48.9 270 top
R1  42.74,58.48 0 top
R2  57.34,32.89 90 top
R3  57.28,21.08 180 top
R4  75.37,51.5 270 top
R5  76.52,29.91 90 top
R6  86.38,9.49 0 top
R7  85.42,32.07 270 top
R8  59.12,9.91 90 top
R9  161.04,17.4 270 top
R10  157.04,27.18 270 top
R11  114.98,17.63 90 top
R12  117.26,32.49 270 top
R13  36.77,9.02 90 top
R14  73.28,9.62 90 top
R15  70.58,28.86 180 top
R16  98.51,17.47 90 top
R17  100.85,32.18 270 top
R18  40.57,9.14 90 top
R19  146.37,51.69 90 top
R20  155.58,50.74 270 top
R21  129.99,17.42 90 top
R22  133.22,31.96 270 top
R23  127.06,57.34 180 top
R24  160.34,58.04 90 top
R25  42.8,21.15 180 top
R26  61.34,63.75 90 top
R27  57.09,63.75 90 top
R28  52.7,63.82 90 top
R29  19.81,17.97 180 top
T1  90.04,46.74 0 top
T2  90.17,20.76 0 top
T3  105.71,46.74 0 top
T4  105.9,20.83 0 top
T5  122.38,46.74 0 top
T6  122.25,20.89 0 top
T7  137.85,46.74 0 top
T8  137.79,20.83 0 top
TP1  106.36,33.48 0 top
TP2  90.52,33.49 0 top
TP3  138.53,33.52 0 top
TP4  123.08,33.53 0 top
TP5  145.99,76.96 0 top
TP6  117.73,7.87 0 top
U1  72.26,41.47 180 top
U2  157.61,8.51 0 top
U3  74.17,18.54 180 top
U4  153.51,43.56 0 top
VREG1  105.16,88.9 0 top
VREG2  32.64,88.9 0 top
VREG3  69.22,88.96 0 top

### Tracks (layer width: path | path; a pad name or v marks a point on that pad's centre or on a via)
GND  (via drill 0.6)  (49 unrouted)
  Top 0.406: IC1.5 44.26,49.07 44.26,49.02 | 45.53,35.5 JP1.6 v45.47,39.94 | v35.05,40.2 40.26,39.94 40.26,40.13 | C1.1 C2.1 | R25.2 41.4,17.78 43.88,17.78 IC5.10 | 59.94,21.08 59.94,21.02
  Top 0.61: U2.4 159.51,1.14 | U4.4 v155.19,37.27 | v158.88,37.27 167.46,37.27 | U3.4 72.26,21.27 v70.61,21.27 | v91.63,5.4 91.5,10.93 | U1.4 70.36,44.13 v69.09,44.13 | 59.94,21.02 58.99,21.02 58.99,20.95
  Top 0.813: T2.2 87.59,13.78 87.59,10.57 88.87,10.57 | 88.87,10.57 126.16,10.57 | 135.23,10.57 141.67,10.57 141.67,12.6 135.23,12.6 135.23,10.57 | 135.23,10.57 127.13,10.57 126.16,10.57 | 126.16,10.57 126.16,12.57 119.7,12.57 119.7,10.66 | 111.89,10.66 109.78,10.66 109.78,12.27 103.34,12.27 103.34,10.72 | 95.38,10.72 94.08,10.72 | 94.08,10.72 90.42,10.72 | 88.87,12.48 88.9,12.48 88.9,11.5 88.93,11.5 88.93,13.46 88.87,13.46 88.87,10.57 | T2.7 94.08,13.78 94.08,12.27 | 94.08,12.27 94.08,10.72 | 92.71,12.48 92.71,12.27 94.08,12.27 | T2.6 92.71,12.48 | 92.71,12.48 92.83,12.48 92.83,12.33 92.65,12.33 92.65,12.21 88.09,12.21 88.09,10.93 91.5,10.93 93.55,10.93 93.55,11.71 | R16.2 98.51,22.05 D5.A
  Top 1.016: IC2.2 160.34,64.9 167.51,64.9 | C10.1 164.15,59.63 167.51,59.63 | C9.1 IC3.2 | R21.2 130.05,18.82 | 130.05,18.82 130.05,18.86 | 130.05,18.82 130.05,18.67
  Top 1.27: 141.67,12.6 141.67,11.3 144.91,11.3 144.91,15.96 D20.A | D5.A 98.16,21.46 95.38,17.65 95.38,10.72 | D15.A 114.43,22.3 114.43,20.19 111.89,17.65 111.89,10.66 | D10.A 130.11,20.64 127.13,17.65 127.13,10.57 | C12.- 108.14,91.29 108.14,91.5 | C14.1 113.86,84.01 113.86,90.78 | 87.95,91.25 87.95,90.49 | 87.95,91.57 87.95,91.25 | 87.95,91.25 50.74,91.25 | 50.74,91.19 50.74,91.25 | 50.74,91.25 30.35,91.25 30.35,91.19 10.41,91.19 | C13.1 26.23,84.71 28.83,84.71
  Top 1.676: 141.67,10.57 141.67,2.03 142.37,2.03 141.35,1.21 159.51,1.14 167.39,1.21 167.46,37.27 167.51,59.63 167.51,64.9 167.51,91.1 C15.- 157.61,90.78 C17.-
  Top 2.54: C17.- 113.86,90.78 105.16,90.78 VREG1.2
  Bottom 0.406: v45.47,39.94 v35.05,40.2
  Bottom 0.61: v155.19,37.27 v158.88,37.27 | v91.63,5.4 70.68,5.4 v70.61,21.27 69.02,21.21 v69.09,44.13
N$1  (3 unrouted)
  Top 0.813: D1.C 97.52,44.25 97.52,46.31
  Top 1.27: T3.4 105.69,54.32 87.82,54.32 88.39,53.28 88.39,46.86 106.85,46.86 106.92,46.93 | 106.92,46.93 106.92,53.15 106.47,52.7 89.34,52.7 89.03,52.39 89.03,47.31 89.54,47.82 105.84,47.82 106.28,48.26 106.28,51.56 106.22,51.63 90.04,51.63 89.79,51.37 89.79,48.77 90.11,48.96 105.27,48.96 105.39,49.09 105.39,50.55 105.14,50.8 90.42,50.8 90.36,50.74 90.36,49.97 90.68,49.66 104.7,49.66 | D11.C 114.1,44.19 114.1,46.9 106.92,46.9 106.92,46.93 | 97.52,46.31 97.52,43.05 97.92,43.05
  Top 1.422: 106.92,53.15 88.86,53.15 88.86,52.57
N$2  (1 unrouted)
  Top 0.406: U1.2 U1.3 71.63,46.93 71.5,46.99 67.56,46.99 67.37,46.8 64.71,30.48 64.07,29.84 | IC5.18 52.77,4.38 56.71,4.38 56.64,6.79 56.64,9.97 60.58,10.03 60.77,10.22 60.83,21.34 59.94,21.78
  Top 0.61: 60.83,21.34 58.68,21.34 R3.1
N$3
  Top 0.406: IC1.24 52.36,52.32 57.09,52.32 LED3.A
N$4  (1 unrouted)
  Top 0.406: IC1.1 46.1,49.88 46.1,42.93 45.97,42.8 41.72,42.8 41.72,31.3 41.91,30.99 42.29,30.04 42.99,29.08 44.51,27.56 54.04,27.56 54.1,27.5 54.1,25.97 | 54.1,25.97 54.1,17.14 | PAD5.1 53.28,25.97 54.1,25.97
N$5
  Top 0.406: IC1.16 50.86,45.17 50.86,40.89 48.01,40.89 48.01,30.35 50.55,30.35 JP1.1
N$6
  Top 0.406: IC1.17 53.66,46.67 53.66,32.96 JP1.3
N$7  (via drill 0.6)
  other vias: 50.67,39.43
N$8  (1 unrouted)
  Top 0.406: IC1.7 34.42,47.47 34.42,51.88 34.8,51.88 | 34.8,51.88 34.99,51.88 34.99,51.94 | C1.2 34.8,55.12 | 34.86,55.12 34.8,55.12 | 34.8,55.12 34.8,51.88
N$9  (2 unrouted)
  Top 0.406: IC1.8 34.29,46.67 | C2.2 30.61,42.1 34.73,42.1 | 34.8,42.1 34.73,42.1 | 34.73,42.1 34.73,45.59 34.67,45.59 34.67,45.28 34.61,45.28
N$10  (6 unrouted)
  Top 0.406: C5.- 79.21,35.05 71.63,35.05 U1.6
  Top 0.813: T1.2 87.49,27.52 88.07,27.52 93.88,27.52 93.88,35.81 | 93.88,38.17 93.88,38.26 87.93,38.26 87.93,30.67 | 87.93,30.67 87.93,28.12 92.52,28.12 93.24,28.12 93.24,37.54 88.57,37.54 88.57,28.52 92.52,28.52 92.52,36.9 89.09,36.9 | 89.09,36.9 89.09,37.06 | 89.09,36.9 89.09,29.2 91.72,29.2 91.72,36.34 89.53,36.34 89.53,29.8 91.12,29.8 91.12,29.56 91.28,29.56 91.28,35.99 90.09,35.99 90.09,36.15 89.69,36.15 89.69,30.12 90.84,30.12 90.84,36.3 90.36,36.3 90.36,29.32 90.48,29.32 90.48,29.56 | R7.2 87.93,30.67
  Top 1.27: 97.52,35.81 97.52,37.88 D1.A | C5.- 79.38,35.27 83.18,35.27 83.18,27.62 | 83.18,27.56 83.18,27.62 | 83.18,27.62 88.07,27.52 | D5.C 98.16,28.12 92.52,28.12
  Top 1.422: 97.52,35.81 93.88,35.81 93.88,38.17
N$11
  Top 0.406: R2.1 57.38,31.54 LED1.A
N$12  (1 unrouted)
  Top 0.406: U1.7 73.02,38.98 73.02,40.96 73.6,41.53 76.45,41.53 76.52,41.59 76.52,44.7 82.42,44.7 82.42,49.09 80.07,49.02 77.79,49.02 75.31,49.47 | D3.A 78.97,49.98 78.97,49.51
  Top 1.016: D3.A 75.37,49.58 R4.2
N$13  (1 unrouted)
  Top 0.406: U1.5 70.42,31.88 76.45,31.88 80.52,31.94 80.52,31.69
  Top 1.016: R5.2 76.58,31.31 76.58,31.88 80.96,31.88 D4.A
N$14
  Top 0.813: T2.1 86.31,13.78 86.31,12.64 84.98,12.64 84.98,12.45 R6.1 85.09,9.48 85.09,9.27
  Top 1.016: R5.1 76.26,28.51 76.26,27.62 80.96,27.62 D4.C 80.77,27.86 80.77,24.51 84.07,24.51 84.01,24.64 84.03,12.51 84.98,12.45
N$15  (1 unrouted)
  Top 0.406: R4.1 76.15,53.67 D3.C | 86.17,39.12 86.23,38.54 86.23,40.96
  Top 0.813: D3.C 83.88,53.66 | 83.82,53.66 83.88,53.66 | 83.88,53.66 83.88,53.72 | 83.88,53.66 83.88,40.21 86.17,40.21 | 86.17,40.21 86.17,39.12 | R4.1 76.32,53.85 79.31,53.85 | 86.11,40.51 86.11,40.45 | 86.11,40.45 86.11,38.8 | R4.1 76.39,53.91 79.63,53.91 | 85.92,40.45 86.11,40.45 | 86.11,40.45 86.17,40.39 86.17,40.21 | R4.1 75.25,53.02 75.12,53.02 | R7.1 86.23,33.47 86.23,38.54
N$16  (7 unrouted)
  Top 6.452: C15.+ 157.73,76.8 157.73,72.77 128.14,72.77 128.14,75.5 128.4,75.5 128.4,72.64 100.08,72.64
N$17  (via drill 0.6)
  Top 0.61: U2.3 U2.2 157.61,5.91 v157.61,3.62 | R8.1 57.72,8.51 v57.85,3.62 57.91,3.43 50.16,3.43 IC5.16
  Bottom 0.61: v157.61,3.62 157.73,3.56 57.66,3.68 57.85,3.49 v57.85,3.62
N$18  (4 unrouted)
  Top 0.813: T7.4 137.66,53.24 137.66,54.48 122.82,54.48 122.82,53.72 137.15,53.72 137.15,53.47 126.89,53.47 126.89,46.61 132.33,46.61 | 132.33,46.61 133.34,46.61 133.34,53.21 130.41,53.21 127.4,53.21 127.4,47.12 132.83,47.12 132.83,52.7 132.33,52.7 132.33,46.61
  Top 1.27: D6.C 130.41,44.41 130.41,53.21 | 145.42,46.86 141.1,46.86
N$19  (via drill 0.6)  (6 unrouted)
  Top 0.61: U2.6 158.24,13.34 163.39,13.34 163.39,22.04 155.26,22.04 155.26,18.61 150.62,18.61 C6.-
  Top 0.813: T5.3 121.12,39.75 121.12,38.02 119.77,38.02 119.77,38.42 119.81,38.42 119.81,27.05 126.23,27.05 126.23,27.94 126.23,35.34 126.23,38.9 126.19,38.9 126.19,38.06 | 126.19,37.78 126.19,38.06 | 126.19,38.06 120.32,38.06 120.32,27.52 125.63,27.52 125.63,37.42 121.12,37.42 121.12,37.46 120.88,37.46 120.88,31.09 | 120.88,31.09 120.88,28.12 124.95,28.12 124.95,28.48 125.11,28.48 125.11,36.82 121.56,36.82 121.56,36.74 121.28,36.74 121.28,28.88 124.4,28.88 124.4,29 124.52,29 124.52,36.23 121.52,36.23 121.52,29.56 124,29.56 124,35.67 122.2,35.67 122.2,35.55 121.96,35.55 121.96,30.28 123.4,30.28 123.4,35.23 122.72,35.23 122.72,34.95 122.4,34.95 122.4,30.52 122.88,30.52 122.88,35.71 | R12.2 120.88,31.09 | 150.62,18.61 149.16,18.61 v149.16,18.86
  Top 1.016: D10.C 129.92,27.32 v129.92,29.65
  Top 1.27: D6.A 130.4,35.34 126.23,35.34 | D10.C 130.11,27.94 126.23,27.94
  Bottom 0.813: v149.16,18.86 129.92,18.86 v129.92,29.65
N$20
  Top 0.61: R9.2 161.54,16 161.54,15.24 157.42,15.24 D9.A 157.42,14.67 156.97,14.67 U2.7
N$21  (2 unrouted)
  Top 0.61: R10.2 157.04,24.64 164.72,24.64 164.72,11.62 159.7,11.68 159.7,11.94 | D8.A 160.46,24.82
N$22  (via drill 0.6)  (1 unrouted)
  Top 0.61: R10.1 157.04,29.29 D8.C
  Top 0.813: R11.1 114.98,12.57 116.52,12.57 118.24,12.57
  Top 1.016: R10.1 v157.04,30.67 157.04,30.73 | v116.59,14.1 116.59,13.08 116.52,13.08 116.52,12.57
  Bottom 1.016: v157.04,30.67 157.04,30.73 157.1,14.1 v116.59,14.1
N$23  (via drill 0.6)  (1 unrouted)
  Top 0.61: R9.1 161.04,19.88 157.23,19.88
  Top 0.813: T5.1 118.6,39.75 118.6,37.65 117.26,37.65 R12.1
  Top 1.016: D9.C 159.26,19.39 v159.26,20.57 | v117.09,39.31 117.26,39.31 117.26,37.65
  Bottom 1.016: v159.26,20.57 160.08,20.57 160.08,33.53 155.19,33.53 155.19,16.64 117.09,16.64 v117.09,39.31
N$24  (2 unrouted)
  Top 0.406: IC1.28 48.45,53.8 48.45,55.82 49.28,56.64 49.28,58.93
  Top 1.016: C9.2 133.16,57.34 R23.1
N$25
  Top 1.016: IC3.3 131,66.93 123.76,66.93 123.76,57.34 R23.2
N$26  (1 unrouted)
  Top 0.406: U3.2 U3.3 | 63.12,25.97 62.93,25.97 62.93,25.72 | 62.99,25.59 62.93,25.59 62.93,25.72 | 62.93,25.72 62.87,25.72 62.87,25.84 | R13.1 36.89,7.62 37.02,2.48 47.75,2.54 47.82,2.41
  Top 0.61: U3.3 74.36,21.15 74.36,23.75 76.45,23.75 76.45,25.72 74.36,27.3 74.36,30.8 66.99,30.8 66.99,30.86 66.61,30.86 63.12,25.97 | IC5.14 47.82,2.41 62.74,2.41 62.74,21.72 | 62.74,21.78 62.74,21.72 | 62.74,21.72 62.67,21.72 62.67,21.53
N$27  (via drill 0.6)  (7 unrouted)
  Top 0.61: C7.- 80.97,6.03 | 80.97,6.03 80.97,5.46 | U3.6 73.53,13.4 70.87,13.4 70.87,5.21 81.09,5.21 v81.09,9.21 80.96,6.03 80.97,6.03
  Top 0.813: T3.2 103.16,39.75 103.16,30.78 | 103.16,30.78 103.16,27.41 109.54,27.41 109.54,37.28 109.54,38.1 103.68,38.1 103.68,37.74 103.64,37.74 103.64,28.08 107.12,28.08 108.91,28.08 108.91,32.19 | 108.91,32.19 108.91,37.38 104.08,37.38 104.08,28.64 108.27,28.64 108.27,36.7 104.63,36.7 104.63,29.2 107.59,29.2 107.59,36.03 105.11,36.03 105.11,29.68 106.95,29.68 106.95,35.63 105.63,35.63 105.63,35.51 105.67,35.51 105.67,30.32 106.23,30.32 106.23,36.5 | R17.2 103.16,30.78 | C7.- v81.09,9.21 | v110.36,32.19 108.91,32.19
  Top 1.27: 109.54,37.28 109.6,35.41 114.29,35.41 114.29,37.82 D11.A | 109.3,20.85 109.3,20.91 | D15.C 114.26,28.08 107.12,28.08
  Bottom 0.813: v81.09,9.21 105.54,9.21 105.66,29.02 105.66,29.34 110.17,29.21 110.3,32.26 v110.36,32.19
N$28
  Top 0.61: U3.7 74.8,13.34 76.32,13.34 D14.A 73.28,11.7 R14.2
N$29
  Top 0.61: U3.5 72.27,15.11 69.53,15.11 68.22,25.21 D13.A 68.2,25.24 68.2,29.34 69.18,29.34 | 69.41,29.34 69.18,29.34 | 69.18,29.34 R15.2
N$30  (via drill 0.6)  (2 unrouted)
  Top 0.61: R15.1 72.96,28.86 72.96,24.89
  Top 0.813: R16.1 98.51,12.57 | 98.51,12.57 101.73,12.57 | 98.51,12.57 98.49,12.57 v98.49,12.7 | v74.29,25.46 72.32,25.46 D13.C
  Bottom 0.813: v98.49,12.7 74.36,12.76 v74.29,25.46
N$31  (via drill 0.6)
  Top 0.61: D14.C 76.32,6.99 73.02,6.99 73.02,8.22 R14.1
  Top 0.813: T3.1 101.9,37.77 100.85,37.77 | 100.85,37.77 R17.1 | D14.C 76.39,7.6 76.39,7.68 78.68,7.68 v78.68,7.62 | v100.33,39.62 100.08,39.62 100.08,37.78 100.85,37.78 100.85,37.77
  Bottom 0.813: v78.68,7.62 78.68,7.56 112.08,7.49 112.08,39.75 100.33,39.75 v100.33,39.62
N$32  (1 unrouted)
  Top 0.406: IC1.27 49.21,55.18 50.36,56.33 50.36,59.94
  Top 1.016: R24.1 C10.2 164.53,56.64 PAD9.1
N$33  (1 unrouted)
N$34
  Top 0.406: IC1.9 45.15,45.12 45.15,43.94 45.08,43.88 40.83,43.88 40.58,43.62 40.58,41.66 40.26,41.34 39.56,41.34 39.24,41.02 39.24,38.73 39.69,38.29 40.7,38.29 40.7,30.42 44.07,26.04 46.11,26.02 | 46.11,26.02 51.5,25.97 IC5.4 | PAD6.1 46.11,26.02
N$35  (8 unrouted)
  Top 0.61: 139.57,27.75 139.26,29.12 139.13,29.12 | U4.6 154.18,46.18 154.18,43.12 150.3,43.12 150.24,25.4 140.97,25.46 141.1,27.93
  Top 0.813: T7.2 135.32,39.75 135.32,38.14 141.71,38.14 141.65,27.34 135.28,27.41 135.28,38.06 141.23,38.06 141.29,28.43 141.1,27.93 135.76,27.93 135.76,30.35 135.76,37.34 139.89,37.34 140.51,37.34 140.51,36.62 140.47,36.62 140.47,28.4 136.48,28.4 136.48,36.74 139.99,36.74 139.99,36.5 139.91,36.5 139.91,28.64 136.92,28.64 136.92,36.1 139.59,36.1 139.59,35.67 139.55,35.67 139.55,29.12 139.13,29.12 137.52,29.12 137.52,35.75 139.03,35.75 139.03,35.51 139.35,35.51 139.35,29.52 138.04,29.52 138.04,35.51 138.72,35.51 138.72,29.08 138.6,29.08 138.6,29.04
  Top 1.016: D16.A 146.11,42.07 146.3,34.61 139.7,34.54 139.89,37.34
  Top 1.27: D20.C 145.5,21.46 141.1,21.46 | R22.2 133.22,30.35 135.76,30.35
N$36
  Top 0.61: U4.7 152.72,46.18 152.72,53.02 148.72,53.02 148.72,53.09
  Top 0.813: R19.2 148.72,53.09 149.7,53.09 D19.A
N$37  (2 unrouted)
  Top 0.61: 155.19,49.02 155.38,49.02 155.38,45.47
  Top 1.016: D18.A 155.13,48.67 155.13,48.77 155.19,48.77 155.19,49.02
N$38  (2 unrouted)
  Top 0.61: T8.1 133.98,17.91 134.05,17.91 134.05,18.38 147.32,18.51 147.26,20.57
  Top 0.813: R21.1 129.99,12.57 133.48,12.57 | D18.C 159.42,53.21 | 147.26,20.57 153.42,20.57
  Top 1.016: 159.64,53.28 155.58,53.28 R20.1 | 159.42,53.21 161.8,53.21 161.8,45.91 156.84,46.04 156.78,33.21 153.29,33.21 153.42,20.57
N$39
  Top 0.61: 147.32,47.88 147.26,47.88 147.26,47.5 147.19,47.5 147.19,48.13
  Top 0.813: R22.1 133.22,37.83 134.11,37.83 134.11,39.75 T7.1 133.86,39.75 133.86,44.83 147.32,44.39 147.32,47.88 | R19.1 146.56,50.29 146.56,49.28 147.13,49.28 | 147.13,49.28 D19.C | 147.19,48.13 147.13,48.13 147.13,49.28
N$40  (via drill 0.6)
  other vias: 149.16,18.8
N$41  (2 unrouted)
  Top 1.27: VREG3.3 71.88,72.52 51.63,72.45 51.56,76.99 C23.+
N$42  (via drill 0.6)
  Top 0.406: IC1.15 49.97,45.17 49.97,41.91 42.74,41.91 42.74,38.1 | 42.74,38.1 42.74,32.89 45.47,32.89 JP1.4 | IC5.6 48.77,17.92 48.77,21.21 | 48.77,21.21 v48.77,24.07 | v45.34,37.97 45.21,38.1 42.74,38.1 | PAD8.1 49.72,21.21 48.77,21.21
  Bottom 0.406: v48.77,24.07 45.34,27.5 v45.34,37.97
N$43  (via drill 0.6)
  Top 0.406: IC1.10 45.97,45.17 45.97,44.77 46.04,42.86 v41.72,42.74 | v39.56,42.86 38.29,41.59 36.7,41.59 36.64,41.53 36.64,39.05 36.89,38.8 38.04,38.8 38.04,37.97 39.56,36.45 39.56,29.72 39.8,29.42 | 39.8,29.42 43.56,24.7 46.42,21.84 IC5.8 | PAD7.1 39.8,27.67 39.8,29.42
  Bottom 0.406: v41.72,42.74 v39.56,42.86
N$44
  Top 0.406: LED2.C R26.1
N$45  (via drill 0.6)
  Top 0.406: R18.1 40.57,5.21 v45.15,5.21 IC5.12
  Top 0.61: U4.3 U4.2 153.48,40.83 v153.48,38.48
  Bottom 0.406: v45.15,5.21 45.34,5.21 45.34,1.02
  Bottom 0.61: v153.48,38.48 153.48,35.69 162.31,35.69 162.37,1.02 55.88,1.02 55.25,1.02 45.34,1.02
N$46
  Top 0.406: LED3.C R27.1
N$47
  Top 0.406: 52.26,48.26 52.26,48.27 IC1.19 PAD11.1
N$48
  Top 0.406: IC1.23 58.67,51.47 58.67,51.44 61.34,54.1 LED2.A
N$49
  Top 0.406: LED4.C R28.1
N$51
  Top 0.406: IC1.25 52.7,55.66 LED4.A
N$52  (2 unrouted)
  Top 1.27: VREG1.1 102.62,74.17 102.55,74.17 | 102.43,72.01 76.9,72.01 76.9,82.23 66.55,82.23 | 66.55,82.23 66.55,78.68 VREG3.1 | VREG2.1 30.1,82.23 66.55,82.23
N$53
  Top 1.016: R24.2 160.34,59.37 158.05,59.37 158.05,66.93 162.18,66.93 162.18,66.87 IC2.3
N$54  (1 unrouted)
  Top 0.406: IC1.30 46.8,55.31 46.29,55.82 41.21,55.82
N$56
  Top 0.406: IC5.1 55.37,17.67 55.37,14.92 55.31,14.86 45.21,14.86 45.15,14.92 IC5.9 45.15,19.37 R25.1
N$57  (via drill 0.6)  (2 unrouted)
  Top 0.406: IC5.19 54.04,5.32 v54.04,5.33
  Bottom 0.406: v54.04,5.33 54.04,12.7 54.1,12.7
N$58
  Top 0.406: IC1.22 PAD1.1
N$59  (via drill 0.6)
  other vias: 47.56,56.9
RESET  (via drill 0.6)  (2 unrouted)
  Top 0.406: 50.16,35.24 50.61,35.24 50.61,35.5 JP1.5 50.74,35.5 50.74,39.62 50.67,39.62 50.67,39.5 | 50.67,39.5 50.61,39.5 | 50.67,39.5 50.86,39.5 v50.86,39.43 | IC1.29 47.62,53.76 47.56,57.09 47.56,57.47 46.23,58.8 44.45,58.8 R1.2
  Bottom 0.406: v50.86,39.43 56.26,39.43 56.2,56.9 47.5,56.9
VB_1
  Top 0.406: U1.8 74.2,38.82 C5.+ D2.C
VB_2
  Top 0.61: U3.8 76.08,15.26 C7.+
  Top 0.813: D12.C C7.+
VB_3
  Top 0.61: U4.8 151.64,46.18 151.64,44.51 148.84,44.51 148.84,29.78 146.34,29.78 146.47,29.59
  Top 1.27: C8.+ 146.47,29.59 D17.C
VB_4
  Top 0.61: D7.C C6.+ 155.64,12.17 U2.8
VCC  (7 unrouted)
  Top 0.406: 45.47,29.97 JP1.2 45.53,30.42 45.53,28.7 53.59,28.7 | 48.39,47.43 52.3,47.43 IC1.18 52.3,47.5 55.05,47.5 55.05,43.12 | IC1.4 43.71,49.97 45.78,49.97 45.78,48.27 IC1.6 48.26,48.27 48.26,47.43 48.39,47.43 | 48.39,47.43 48.39,47.62 | 53.59,28.7 53.59,31.75 55.05,31.75 55.05,34.16 | 55.05,34.16 55.05,37.72 | 55.05,37.72 55.05,43.12 | C4.2 57.34,37.72 55.05,37.72 | C3.+ 57.7,43.12 55.05,43.12 | R2.2 57.21,34.16 55.05,34.16 | IC5.11 43.88,10.35 | 43.88,10.35 43.88,10.79 44.01,10.92 55.37,10.97 | 55.37,10.97 58.93,10.99 58.99,18.73 56.64,20.07 55.37,20.07 55.05,20.38 55.05,21.08 55.05,28.7 53.59,28.7 | 43.88,10.35 40.57,10.35 R18.2 40.57,10.42 R13.2 | IC5.20 55.31,10.91 55.37,10.97
  Top 0.61: IC5.11 43.94,7.67 43.94,7.05 43.88,7.05 43.88,7.43 | R3.2 55.05,21.08
  Top 1.27: VREG1.3 107.7,81.21 | 107.7,81.21 107.7,82.04 88.2,82.23 88.2,75.25 | C14.2 107.7,81.21
VCCINT  (via drill 0.6)  (2 unrouted)
  Top 0.406: U1.1 74.54,44.46 77.03,46.94 D2.A
  Top 0.61: D12.A 76.08,22.17 76.08,21.4 | D7.A 155.64,5 U2.1 155.7,5.08 v147.57,5.08 | D17.A v151.51,23.42 151.64,41.72 | v74.42,47.56 74.54,44.46 | 76.08,21.4 U3.1 | 76.08,21.4 v77.28,21.4
  Top 1.27: C11.+ 10.73,72.39 26.23,72.39 | 26.23,72.39 35.12,72.39 35.12,78.62 VREG2.3 | C13.2 26.23,72.39
  Bottom 0.61: v147.57,5.08 114.55,5.08 114.55,47.5 113.67,47.5 | 113.67,47.5 77.28,47.56 | 77.28,47.56 v74.42,47.56 | v151.51,23.42 133.22,23.43 133.22,47.5 113.67,47.5 | v77.28,21.4 77.28,47.56 | 77.28,47.56
(copper drawn outside any net)
  shapes: Top area x14